# EAGLE schematic LinxBreakout (EAGLE 7.7.0)
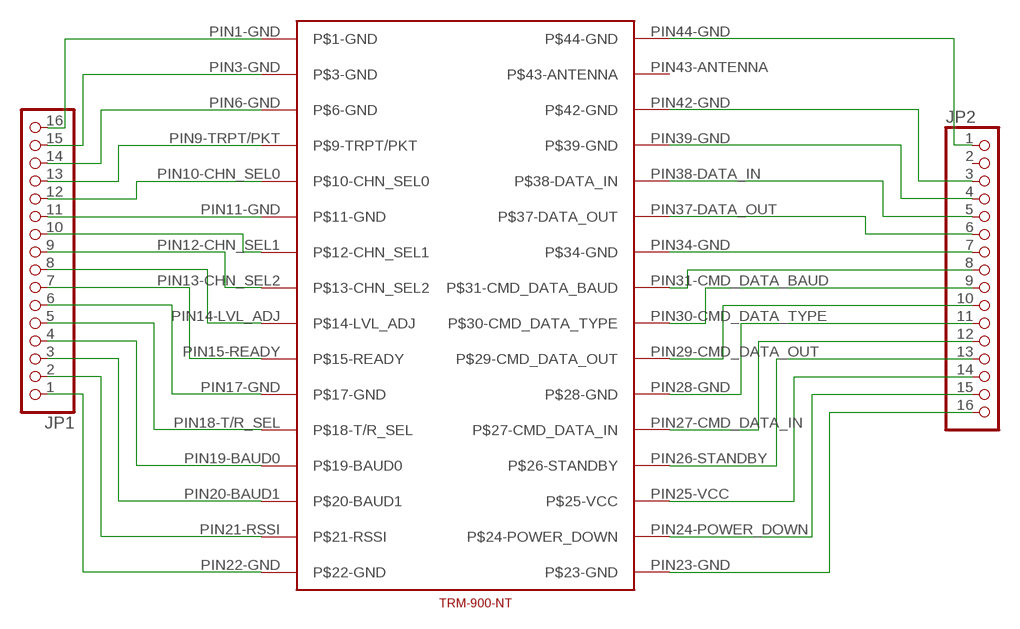
[diagram p0: schematic, sheet 1]

## Parts
JP1  PINHD-1X16  [1X16]
JP2  PINHD-1X16  [1X16]
U$1  TRM-900-NT  [TRM-900-NT]

## Nets
N$1: JP1.16 U$1.PIN1-GND(P$1-GND)
N$2: JP1.15 U$1.PIN3-GND(P$3-GND)
N$3: JP1.14 U$1.PIN6-GND(P$6-GND)
N$4: JP1.13 U$1.PIN9-TRPT/PKT(P$9-TRPT/PKT)
N$5: JP1.12 U$1.PIN10-CHN_SEL0(P$10-CHN_SEL0)
N$6: JP1.11 U$1.PIN11-GND(P$11-GND)
N$7: JP1.10 U$1.PIN12-CHN_SEL1(P$12-CHN_SEL1)
N$8: JP1.9 U$1.PIN13-CHN_SEL2(P$13-CHN_SEL2)
N$9: JP1.8 U$1.PIN14-LVL_ADJ(P$14-LVL_ADJ)
N$10: JP1.7 U$1.PIN15-READY(P$15-READY)
N$11: JP1.6 U$1.PIN17-GND(P$17-GND)
N$12: JP1.5 U$1.PIN18-T/R_SEL(P$18-T/R_SEL)
N$13: JP1.4 U$1.PIN19-BAUD0(P$19-BAUD0)
N$14: JP1.3 U$1.PIN20-BAUD1(P$20-BAUD1)
N$15: JP1.2 U$1.PIN21-RSSI(P$21-RSSI)
N$16: JP1.1 U$1.PIN22-GND(P$22-GND)
N$17: JP2.1 U$1.PIN44-GND(P$44-GND)
N$19: JP2.3 U$1.PIN42-GND(P$42-GND)
N$20: JP2.4 U$1.PIN39-GND(P$39-GND)
N$21: JP2.5 U$1.PIN38-DATA_IN(P$38-DATA_IN)
N$22: JP2.6 U$1.PIN37-DATA_OUT(P$37-DATA_OUT)
N$23: JP2.7 U$1.PIN34-GND(P$34-GND)
N$24: JP2.8 U$1.PIN31-CMD_DATA_BAUD(P$31-CMD_DATA_BAUD)
N$25: JP2.9 U$1.PIN30-CMD_DATA_TYPE(P$30-CMD_DATA_TYPE)
N$26: JP2.10 U$1.PIN29-CMD_DATA_OUT(P$29-CMD_DATA_OUT)
N$27: JP2.11 U$1.PIN28-GND(P$28-GND)
N$28: JP2.12 U$1.PIN27-CMD_DATA_IN(P$27-CMD_DATA_IN)
N$29: JP2.13 U$1.PIN26-STANDBY(P$26-STANDBY)
N$30: JP2.14 U$1.PIN25-VCC(P$25-VCC)
N$31: JP2.15 U$1.PIN24-POWER_DOWN(P$24-POWER_DOWN)
N$32: JP2.16 U$1.PIN23-GND(P$23-GND)
Unconnected: JP2.2 U$1.PIN43-ANTENNA(P$43-ANTENNA)

## Library data of the parts
JP1 JP2 = pinhead:PINHD-1X16: PIN HEADER
U$1 = LinxICDescription:TRM-900-NT